# EAGLE design Wireless (EAGLE 9.5.0)
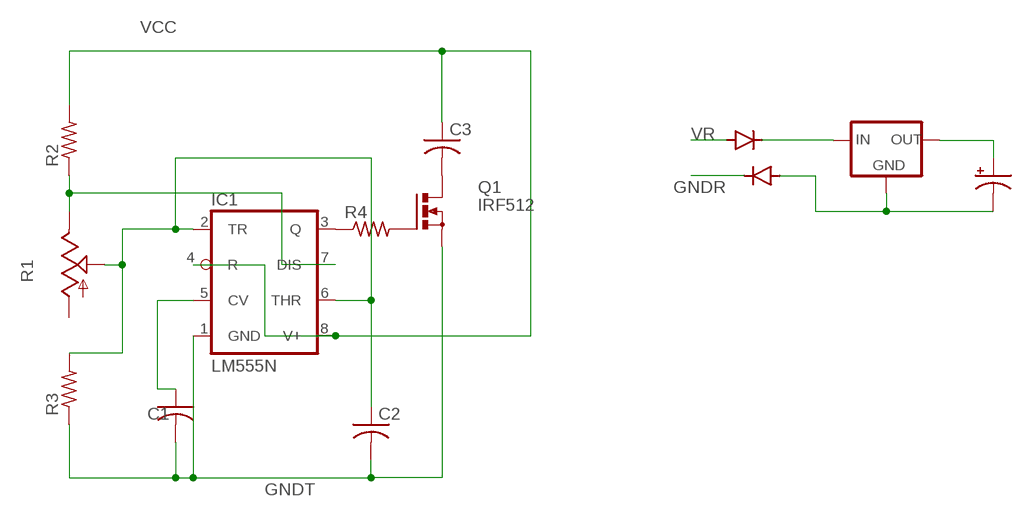
[diagram p0: schematic, sheet 1]

## Parts
C1  C-US050-025X075  [C050-025X075]
C2  C-US050-025X075  [C050-025X075]
C3  C-US050-025X075  [C050-025X075]
C4  CPOL-USE2.5-6  [E2,5-6]
D1  1N4004  [DO41-10]
D2  1N4004  [DO41-10]
IC1  LM555N  [DIL08-ROUND]
IC2  78XXS  [78XXS]
Q1  IRF512  [TO220BV]
R1  TRIM_US-CA6V  [CA6V]
R2  R-US_0207/10  [0207/10]
R3  R-US_0207/10  [0207/10]
R4  R-US_0207/10  [0207/10]

## Nets
+: C4.+ IC2.OUT
-: C4.- D2.A IC2.GND
GNDR: D2.C
GNDT: C1.2 C2.2 IC1.1(GND) Q1.S R3.1
N$1: IC1.7(DIS) R1.E R2.1
N$2: IC1.3(Q) R4.1
N$3: Q1.G R4.2
N$5: C2.1 IC1.2(TR) IC1.6(THR) R1.S R3.2
N$7: C1.1 IC1.5(CV)
N$9: D1.C IC2.IN
OUT: C3.2 Q1.D
VCC: C3.1 IC1.4(R) IC1.8(V+) R2.2
VR: D1.A
Unconnected: R1.A

## Library data of the parts
C1-C3 = rcl:C-US: CAPACITOR, American symbol; SPICEPREFIX: C
C4 = rcl:CPOL-US: POLARIZED CAPACITOR, American symbol; SPICEPREFIX: C
D1 D2 = diode:1N4004: DIODE general purpose rectifier, 1 A
IC1 = adafruit:*555: TIMER Changed DIP package to have round (not oval) pin pads http://www.ladyada.net/library/pcb/eaglelibrary.html
IC2 = v-reg:78XXS: VOLTAGE REGULATOR
Q1 = transistor-power:IRF512: N-CHANNEL MOS FET
R1 = pot:TRIM_US-: POTENTIOMETER
R2-R4 = rcl:R-US_: RESISTOR, American symbol; SPICEPREFIX: R

## Board
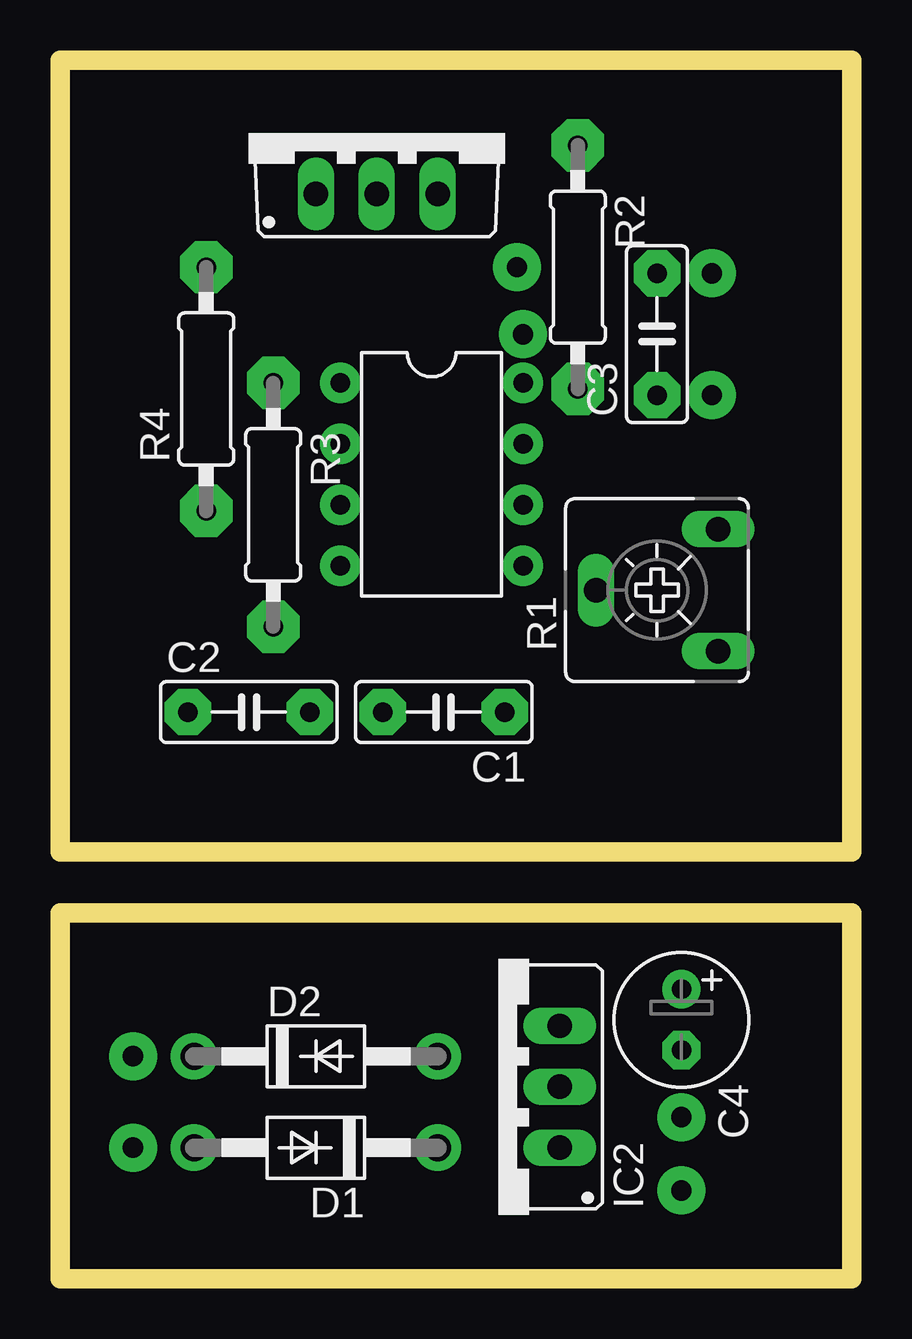
[diagram p1: board, top side]
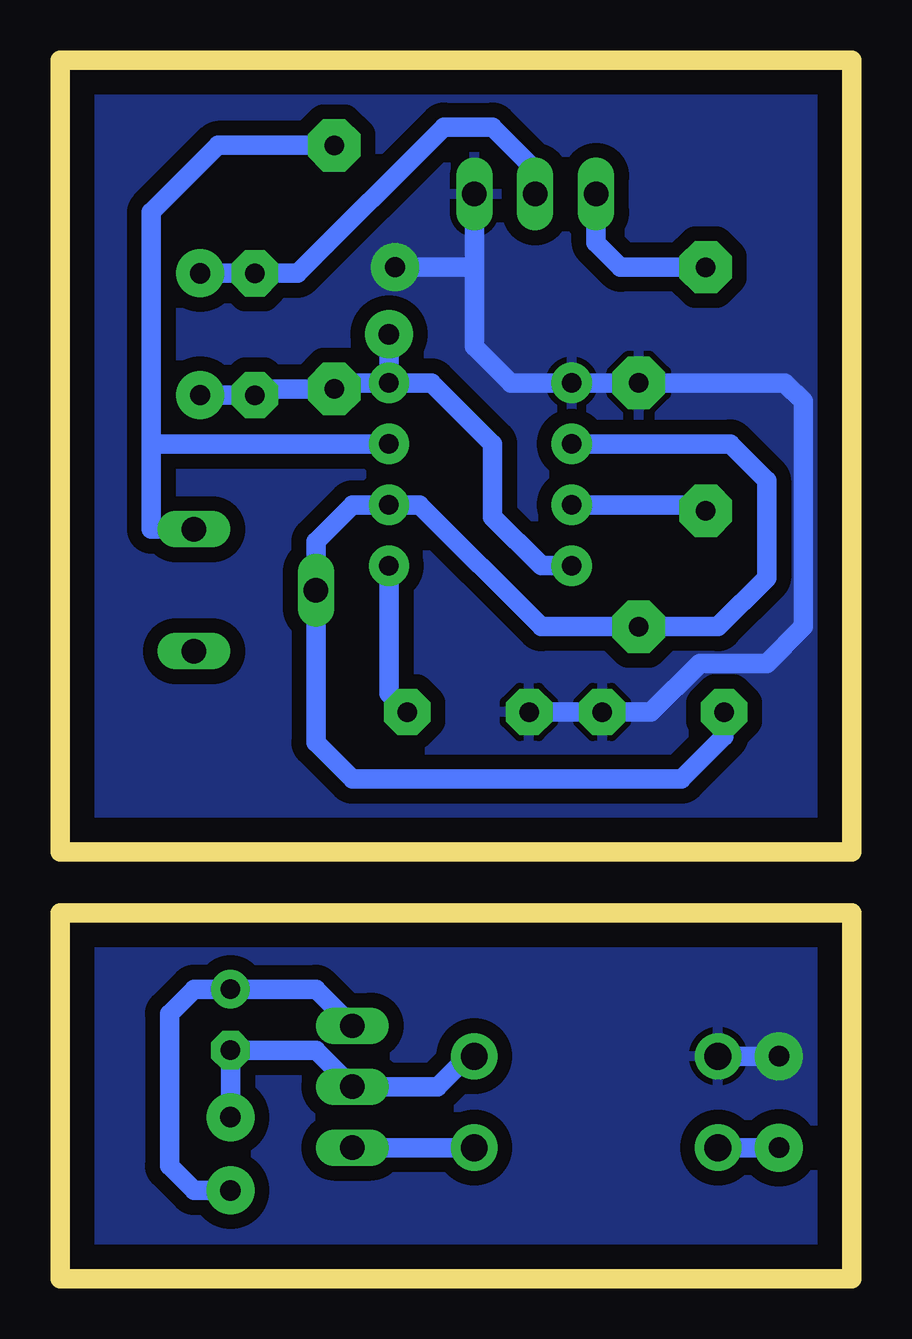
[diagram p2: board, bottom side, seen from below]

Size 33.02 x 50.8 mm. Coordinates in mm from the lower left corner, seen from the top.
Outline: 0,15.24 33.02,15.24 33.02,0 0,0 0,15.24
Outline: 0,17.78 33.02,17.78 33.02,50.8 0,50.8 0,17.78
Copper layers (1*16): Top 0.035mm / dielectric 1.5mm / Bottom 0.035mm
Design rules "default": minimum track width 6mil, minimum drill 0.35mm, track to track 24mil, track to pad 24mil, pad to pad 24mil, via to via 24mil, smd to smd 24mil, copper to edge 40mil, drill to drill 6mil, minimum pad ring 10mil, minimum via ring 8mil, stop-mask expansion 4mil, vias tented up to drill 0mil, thermal gap 10mil

### Footprints (pad centres in the part's own frame; a part is rotated, then mirrored left to right if it is on the bottom)
C050-025X075 = drill 0.813 pad 1.93 octagon: 1 -2.54,0; 2 2.54,0
E2,5-6 = drill 0.813 pad 1.6: + -1.27,0 | drill 0.813 pad 1.6 octagon: - 1.27,0
DO41-10 = drill 1.118 pad 1.93: A 5.08,0; C -5.08,0
DIL08-ROUND = drill 0.813 pad 1.676: 1 -3.81,-3.81; 2 -1.27,-3.81; 3 1.27,-3.81; 4 3.81,-3.81; 5 3.81,3.81; 6 1.27,3.81; 7 -1.27,3.81; 8 -3.81,3.81
78XXS = drill 1.016 long: GND 0,-2.54; IN -2.54,-2.54; OUT 2.54,-2.54
TO220BV = drill 1.016 long: D 0,-2.54; G -2.54,-2.54; S 2.54,-2.54
CA6V = drill 1.016 long: A -2.54,-2.54; E 2.54,-2.54; S 0,2.54
0207/10 = drill 0.813 pad 2.184 octagon: 1 -5.08,0; 2 5.08,0

### Placement (x,y rotation side)
C1  16,23.62 180 top
C2  7.87,23.62 0 top
C3  24.89,39.37 90 top
C4  25.91,10.79 270 top
D1  10.67,5.46 180 top
D2  10.67,9.27 0 top
IC1  15.49,33.53 270 top
IC2  18.29,8 90 top
Q1  13.21,47.75 0 top
R1  24.89,28.7 90 top
R2  21.59,42.16 270 top
R3  8.89,32.26 270 top
R4  6.1,37.08 90 top

### Tracks (layer width: path | path; a pad name or v marks a point on that pad's centre or on a via)
+  (via drill 0.85 pad 2)
  Bottom 0.813: IC2.OUT 22.35,12.06 C4.+ 27.43,12.06 28.45,11.05 28.45,4.7 27.43,3.68 v25.91,3.68
-  (via drill 0.85 pad 2)
  Bottom 0.813: D2.A 16,9.27 17.27,8 IC2.GND 22.35,9.53 C4.- v25.91,6.73
GNDR  (via drill 0.85 pad 2)
  Bottom 0.813: v3.05,9.27 4.83,9.27 5.08,9.02 5.33,9.02 D2.C
  pour Bottom: 0,15.24 33.02,15.24 33.02,0 0,0
GNDT  (via drill 0.85 pad 2)
  Bottom 0.813: C1.2 C2.2 8.38,23.62 6.35,25.65 3.56,25.65 2.03,27.18 2.03,36.58 2.79,37.34 R3.1 IC1.1 | IC1.1 14.22,37.34 15.75,38.86 15.75,42.42 | IC1.1 11.43,37.59 | Q1.S 15.75,42.42 | v19.05,42.16 16,42.16 15.75,42.42
  pour Bottom: 0,50.8 33.02,50.8 33.02,18.03 33.02,17.78 0,17.78
N$1
  Bottom 0.813: 29.21,34.8 29.21,31.24 R1.E | R2.1 26.42,47.24 29.21,44.45 29.21,34.8 | 29.21,34.8 IC1.7
N$2
  Bottom 0.813: IC1.3 6.35,32.26 R4.1
N$3
  Bottom 0.813: R4.2 9.65,42.16 10.67,43.18 Q1.G
N$5
  Bottom 0.813: C2.1 5.33,22.61 7.11,20.83 20.83,20.83 22.35,22.35 R1.S 22.35,30.73 20.83,32.26 IC1.6 18.03,32.26 12.95,27.18 R3.2 5.59,27.18 3.56,29.21 3.56,33.27 5.08,34.8 IC1.2
N$7
  Bottom 0.813: IC1.5 19.3,24.38 C1.1
N$9
  Bottom 0.813: D1.C IC2.IN
OUT  (via drill 0.85 pad 2)
  Bottom 0.813: v27.18,41.91 C3.2 23.11,41.91 17.02,48.01 14.99,48.01 13.21,46.23 Q1.D
VCC  (via drill 0.85 pad 2)
  Bottom 0.813: IC1.8 21.34,37.34 R2.2 24.64,37.08 C3.1 v27.18,36.83 | IC1.8 17.53,37.34 14.99,34.8 14.99,31.75 12.95,29.72 IC1.4 | v19.3,39.37 IC1.8
VR  (via drill 0.85 pad 2)
  Bottom 0.813: v3.05,5.46 D1.A